# Altium schematic sheet S02-DRIVER.SchDoc
size B; SheetNumber: 3; SheetTotal: 4; BLOCK-TITLE: LED OUTPUT DRIVER; BLOCK-SIZE: B; BLOCK-PROJECT: MULTIMOD LED MODULE; BLOCK-REVISION: 1; BLOCK-ORGANIZATION: UNIVERSITY OF FLORIDA; BLOCK-DESIGNER: MEHRON TALEBI; BLOCK-IDENTIFIER: SUMMER 2023; BLOCK-REVIEWER: MIKE STAPLETON
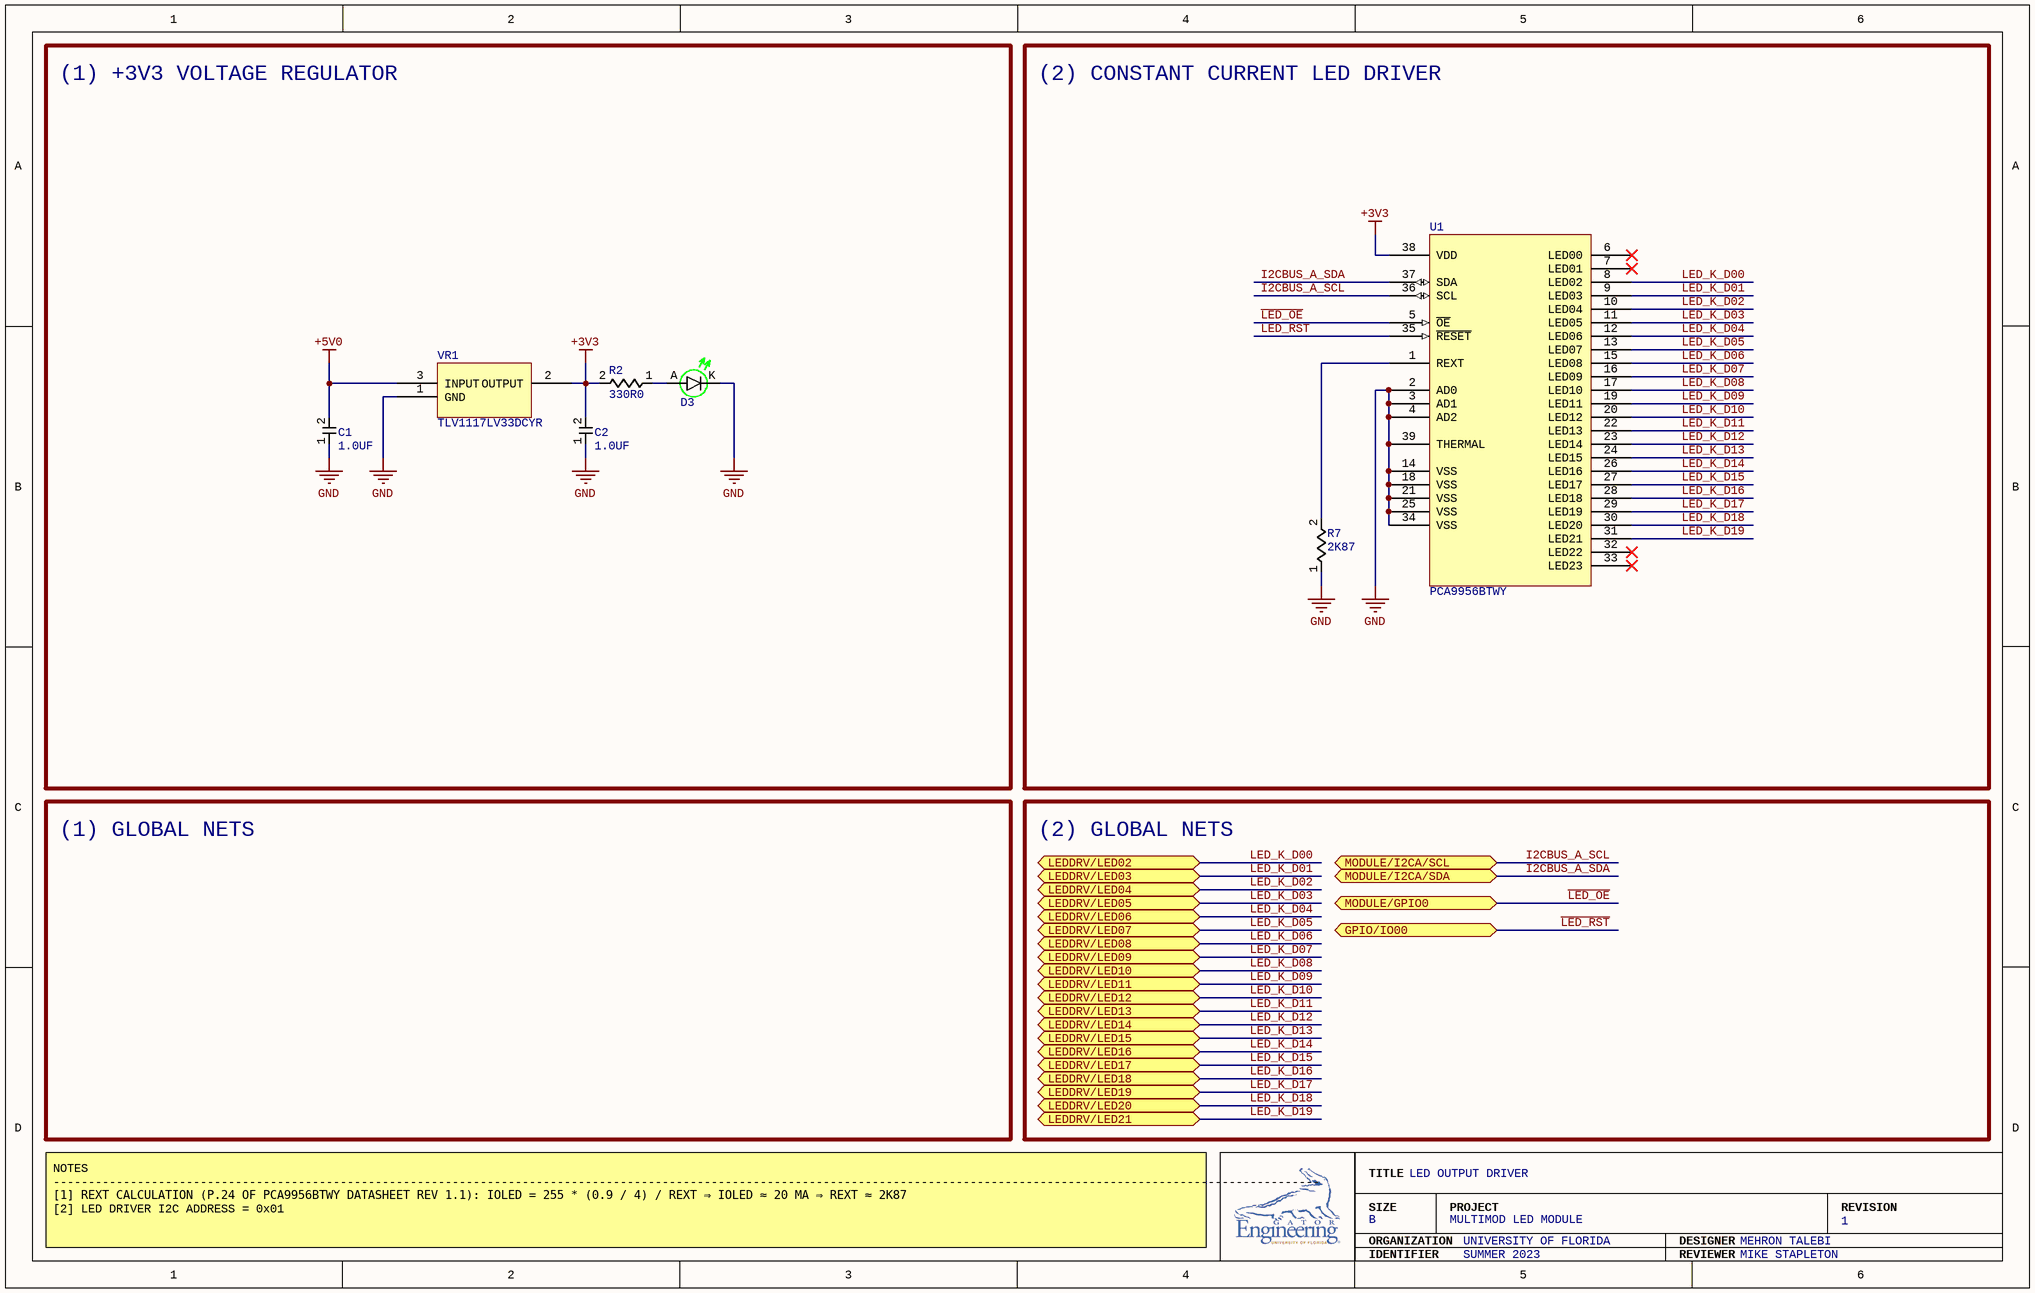
[diagram p0: S02-DRIVER.SchDoc]

## Parts
C1  1.0UF  [CL21B105KAFNFNE]
C2  1.0UF  [CL21B105KAFNFNE]
D3  LTST-C171GKT  [LTST-C171GKT]  (value not drawn)
R2  330R0  [RC0805FR-7W330RL]
R7  2K87  [RC0805FR-0710KL]
U1  PCA9956BTWY  [PCA9956BTWY]
VR1  TLV1117LV33DCYR  [TLV1117LV33DCYR]

## Blocks framed on the sheet
(1) +3V3 VOLTAGE REGULATOR: C1 C2 D3 R2 VR1
(2) CONSTANT CURRENT LED DRIVER: R7 U1

## Ports
GPIO/IO00 (bidir), LEDDRV/LED02 (bidir), LEDDRV/LED03 (bidir), LEDDRV/LED04 (bidir), LEDDRV/LED05 (bidir), LEDDRV/LED06 (bidir), LEDDRV/LED07 (bidir), LEDDRV/LED08 (bidir), LEDDRV/LED09 (bidir), LEDDRV/LED10 (bidir), LEDDRV/LED11 (bidir), LEDDRV/LED12 (bidir), LEDDRV/LED13 (bidir), LEDDRV/LED14 (bidir), LEDDRV/LED15 (bidir), LEDDRV/LED16 (bidir), LEDDRV/LED17 (bidir), LEDDRV/LED18 (bidir), LEDDRV/LED19 (bidir), LEDDRV/LED20 (bidir), LEDDRV/LED21 (bidir), MODULE/GPIO0 (bidir), MODULE/I2CA/SCL (bidir), MODULE/I2CA/SDA (bidir)

## Nets
+3V3: C2.2 R2.2 U1.38(VDD) VR1.2(OUTPUT)
+5V0: C1.2 VR1.3(INPUT)
GND: C1.1 C2.1 D3.K R7.1 U1.2(AD0) U1.3(AD1) U1.4(AD2) U1.14(VSS) U1.18(VSS) U1.21(VSS) U1.25(VSS) U1.34(VSS) U1.39(THERMAL) VR1.1(GND)
~{LED_OE}: U1.5(~{OE}) ; port MODULE/GPIO0
~{LED_RST}: U1.35(~{RESET}) ; port GPIO/IO00
I2CBUS_A_SCL: U1.36(SCL) ; port MODULE/I2CA/SCL
I2CBUS_A_SDA: U1.37(SDA) ; port MODULE/I2CA/SDA
LED_K_D00: U1.8(LED02) ; port LEDDRV/LED02
LED_K_D01: U1.9(LED03) ; port LEDDRV/LED03
LED_K_D02: U1.10(LED04) ; port LEDDRV/LED04
LED_K_D03: U1.11(LED05) ; port LEDDRV/LED05
LED_K_D04: U1.12(LED06) ; port LEDDRV/LED06
LED_K_D05: U1.13(LED07) ; port LEDDRV/LED07
LED_K_D06: U1.15(LED08) ; port LEDDRV/LED08
LED_K_D07: U1.16(LED09) ; port LEDDRV/LED09
LED_K_D08: U1.17(LED10) ; port LEDDRV/LED10
LED_K_D09: U1.19(LED11) ; port LEDDRV/LED11
LED_K_D10: U1.20(LED12) ; port LEDDRV/LED12
LED_K_D11: U1.22(LED13) ; port LEDDRV/LED13
LED_K_D12: U1.23(LED14) ; port LEDDRV/LED14
LED_K_D13: U1.24(LED15) ; port LEDDRV/LED15
LED_K_D14: U1.26(LED16) ; port LEDDRV/LED16
LED_K_D15: U1.27(LED17) ; port LEDDRV/LED17
LED_K_D16: U1.28(LED18) ; port LEDDRV/LED18
LED_K_D17: U1.29(LED19) ; port LEDDRV/LED19
LED_K_D18: U1.30(LED20) ; port LEDDRV/LED20
LED_K_D19: U1.31(LED21) ; port LEDDRV/LED21
NetD3_A: D3.A R2.1
NetR7_2: R7.2 U1.1(REXT)

Not connected (* = marked no-connect by the designer): U1 6(LED00)* 7(LED01)* 32(LED22)* 33(LED23)*

## Notes on the sheet
- (1) GLOBAL NETS
- (2) GLOBAL NETS
- NOTES
  -------------------------------------------------------------------------------------------------------------------------------------------------------------------------------------
  [1] REXT CALCULATION (P.24 OF PCA9956BTWY DATASHEET REV 1.1): IOLED = 255 * (0.9 / 4) / REXT ⇒ IOLED ≈ 20 MA ⇒ REXT ≈ 2K87
  [2] LED DRIVER I2C ADDRESS = 0x01
- TITLE
- SIZE
- ORGANIZATION
- PROJECT
- DESIGNER
- REVISION
- IDENTIFIER
- REVIEWER

## Library data of the parts
C1 C2 = CL21B105KAFNFNE: CAP CER 1UF 25V X7R 0805; Capacitance: 1 µF; Tolerance: ±10%; Voltage - Rated: 25V; Temperature Coefficient: X7R; Operating Temperature: -55°C ~ 125°C; Applications: General Purpose; Mounting Type: Surface Mount, MLCC; Package / Case: 0805 (2012 Metric); Size / Dimension: 0.079" L x 0.049" W (2.00mm x 1.25mm); Thickness (Max): 0.053" (1.35mm); Supplier 1: Arrow Electronics; Supplier Part Number 1: CL21B105KAFNFNE
D3 = LTST-C171GKT: LED GREEN CLEAR CHIP SMD; Configuration: Standard; Lens Color: Colorless; Millicandela Rating: 12mcd; Lens Style: Rectangle with Flat Top; Lens Size: 1.40mm x 1.25mm; Voltage - Forward (Vf) (Typ): 2.1V; Current - Test: 20mA; Viewing Angle: 130°; Wavelength - Dominant: 569nm; Wavelength - Peak: 565nm; Color: Green; Lens Transparency: Clear; Mounting Type: Surface Mount; Package / Case: 0805 (2012 Metric); Supplier Device Package: Chip LED; Size / Dimension: 2.00mm L x 1.25mm W; Height (Max): 0.90mm; Supplier 1: Digi-Key; Supplier Part Number 1: 160-1423-1-ND
R2 = RC0805FR-7W330RL: RES 330 OHM 1% 1/4W 0805; Resistance: 330 Ohms; Power (Watts): 0.25W, 1/4W; Temperature Coefficient: ±100ppm/°C; Tolerance: ±1%; Composition: Thick Film; Features: Moisture Resistant; Operating Temperature: -55°C ~ 155°C; Supplier Device Package: 0805; Size / Dimension: 0.079" L x 0.049" W (2.00mm x 1.25mm); Height - Seated (Max): 0.024" (0.60mm); Number of Terminations: 2; Supplier 1: Mouser; Supplier Part Number 1: 603-RC0805FR-7W330RL
R7 = RC0805FR-072K87L: RES 2.87K OHM 1% 1/8W 0805; Resistance: 2.87 kOhms; Power (Watts): 0.125W, 1/8W; Temperature Coefficient: ±100ppm/°C; Tolerance: ±1%; Composition: Thick Film; Features: Moisture Resistant; Operating Temperature: -55°C ~ 155°C; Package / Case: 0805 (2012 Metric); Supplier Device Package: 0805; Size / Dimension: 0.079" L x 0.049" W (2.00mm x 1.25mm); Height - Seated (Max): 0.024" (0.60mm); Number of Terminations: 2; Supplier 1: Future Electronics; Supplier Part Number 1: 1021979
U1 = PCA9956BTWY: IC LED DRV LIN PWM 65MA 38HTSSOP; Internal Switch(s): Yes; Number of Outputs: 24; Voltage - Supply (Min): 3V; Voltage - Supply (Max): 5.5V; Type: Linear; Current - Output / Channel: 65mA; Dimming: PWM; Applications: Backlight; Operating Temperature: -40°C ~ 85°C (TA); Mounting Type: Surface Mount; Package / Case: 38-TFSOP (0.173", 4.40mm Width) Exposed Pad; Supplier Device Package: 38-HTSSOP; Supplier 1: Arrow Electronics; Supplier Part Number 1: PCA9956BTWY
VR1 = TLV1117LV33DCYR: IC REG LINEAR 3.3V 1A SOT223-4; Output Configuration: Positive; Output Type: Fixed; Number of Regulators: 1; Voltage - Input (Max): 5.5V; Voltage Dropout (Max): 1.3V @ 800mA; Current - Quiescent (Iq): 100 µA; PSRR: 75dB (120Hz); Protection Features: Over Current, Over Temperature; Voltage - Output (Min/Fixed): 3.3V; Current - Output: 1A; Operating Temperature: -40°C ~ 125°C; Mounting Type: Surface Mount; Package / Case: TO-261-4, TO-261AA; ComponentLink1Description: Datasheet; ComponentLink1URL: https://www.ti.com/lit/ds/symlink/tlv1117lv.pdf; Supplier 1: Digi-Key; Supplier Part Number 1: 296-28778-1-ND